# Altium schematic sheet AnalogOutput.SchDoc: Analog output
size A3; Author: eldar6776@hotmail.com; DrawnBy: Eldar Dediæ; Organization: PROVEN d.o.o.; Address1: Adema Buæe 102; Address2: 71000 Sarajevo; Address3: Federacija BiH; Address4: Bosna i Hercegovina; DocumentNumber: DE211213; Revision: 001; SheetNumber: 6; SheetTotal: 15; ProjectName: MIKSER SIROVINE
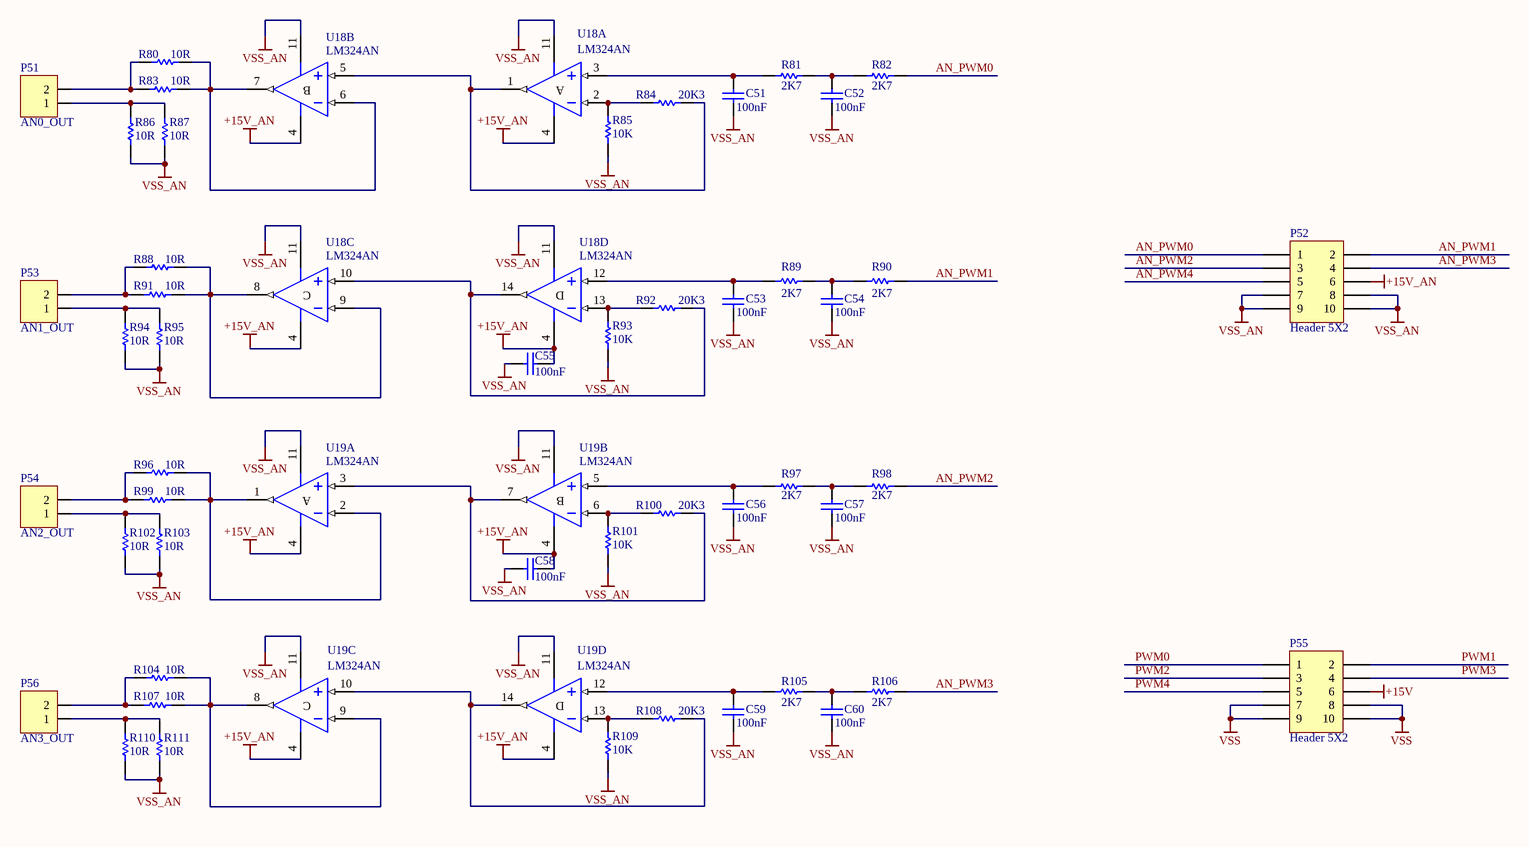
[diagram p0: AnalogOutput.SchDoc]

## Parts
C51  value 100nF  [1206]
C52  value 100nF  [1206]
C53  value 100nF  [1206]
C54  value 100nF  [1206]
C55  value 100nF  [1206]
C56  value 100nF  [1206]
C57  value 100nF  [1206]
C58  value 100nF  [1206]
C59  value 100nF  [1206]
C60  value 100nF  [1206]
P51  AN0_OUT  [TERMINAL BLOK 2]
P52  Header 5X2  [HDR2X5]
P53  AN1_OUT  [TERMINAL BLOK 2]
P54  AN2_OUT  [TERMINAL BLOK 2]
P55  Header 5X2  [HDR2X5]
P56  AN3_OUT  [TERMINAL BLOK 2]
R80  10R  [ERA-0603]
R81  2K7  [ERA-0603]
R82  2K7  [ERA-0603]
R83  10R  [ERA-0603]
R84  20K3  [ERA-0603]
R85  10K  [ERA-0603]
R86  10R  [ERA-0603]
R87  10R  [ERA-0603]
R88  10R  [ERA-0603]
R89  2K7  [ERA-0603]
R90  2K7  [ERA-0603]
R91  10R  [ERA-0603]
R92  20K3  [ERA-0603]
R93  10K  [ERA-0603]
R94  10R  [ERA-0603]
R95  10R  [ERA-0603]
R96  10R  [ERA-0603]
R97  2K7  [ERA-0603]
R98  2K7  [ERA-0603]
R99  10R  [ERA-0603]
R100  20K3  [ERA-0603]
R101  10K  [ERA-0603]
R102  10R  [ERA-0603]
R103  10R  [ERA-0603]
R104  10R  [ERA-0603]
R105  2K7  [ERA-0603]
R106  2K7  [ERA-0603]
R107  10R  [ERA-0603]
R108  20K3  [ERA-0603]
R109  10K  [ERA-0603]
R110  10R  [ERA-0603]
R111  10R  [ERA-0603]
U18  LM324AN  [DIP14]  (parts A,B,C,D of 4)
U19  LM324AN  [DIP14]  (parts A,B,C,D of 4)

## Nets
+15V: P55.6
+15V_AN: C55.1 C58.1 P52.6 U18.4(V+) U19.4(V+)
VSS: P55.7 P55.8 P55.9 P55.10
VSS_AN: C51.1 C52.1 C53.1 C54.1 C55.2 C56.1 C57.1 C58.2 C59.1 C60.1 P52.7 P52.8 P52.9 P52.10 R85.1 R86.1 R87.1 R93.1 R94.1 R95.1 R101.1 R102.1 R103.1 R109.1 R110.1 R111.1 U18.11(V-) U19.11(V-)
AN_PWM0: P52.1 R82.2
AN_PWM1: P52.2 R90.2
AN_PWM2: P52.3 R98.2
AN_PWM3: P52.4 R106.2
AN_PWM4: P52.5
PWM0: P55.1
PWM1: P55.2
PWM2: P55.3
PWM3: P55.4
PWM4: P55.5
NetC51_2: C51.2 R81.1 U18.3(IN+)
NetC52_2: C52.2 R81.2 R82.1
NetC53_2: C53.2 R89.1 U18.12(IN+)
NetC54_2: C54.2 R89.2 R90.1
NetC56_2: C56.2 R97.1 U19.5(IN+)
NetC57_2: C57.2 R97.2 R98.1
NetC59_2: C59.2 R105.1 U19.12(IN+)
NetC60_2: C60.2 R105.2 R106.1
NetP51_1: P51.1 R86.2 R87.2
NetP51_2: P51.2 R80.2 R83.2
NetP53_1: P53.1 R94.2 R95.2
NetP53_2: P53.2 R88.2 R91.2
NetP54_1: P54.1 R102.2 R103.2
NetP54_2: P54.2 R96.2 R99.2
NetP56_1: P56.1 R110.2 R111.2
NetP56_2: P56.2 R104.2 R107.2
NetR80_1: R80.1 R83.1 U18.6(IN-) U18.7(OUT)
NetR84_1: R84.1 R85.2 U18.2(IN-)
NetR84_2: R84.2 U18.1(OUT) U18.5(IN+)
NetR88_1: R88.1 R91.1 U18.8(OUT) U18.9(IN-)
NetR92_1: R92.1 R93.2 U18.13(IN-)
NetR92_2: R92.2 U18.10(IN+) U18.14(OUT)
NetR96_1: R96.1 R99.1 U19.1(OUT) U19.2(IN-)
NetR100_1: R100.1 R101.2 U19.6(IN-)
NetR100_2: R100.2 U19.3(IN+) U19.7(OUT)
NetR104_1: R104.1 R107.1 U19.8(OUT) U19.9(IN-)
NetR108_1: R108.1 R109.2 U19.13(IN-)
NetR108_2: R108.2 U19.10(IN+) U19.14(OUT)

## Notes on the sheet
- Title
- Size:
- Date:
- A3
- Number:
- Time:
- Revision:
- Sheet
- of
- File:
- (in symbol LM324AN, part A) A
- (in symbol LM324AN, part B) B
- (in symbol LM324AN, part C) C
- (in symbol LM324AN, part D) D

## Library data of the parts
C51-C60 = C1206: Ceramic Chip Capacitor - Standard; Published: 17-Jul-2002; LatestRevisionDate: 19-Mar-2004; LatestRevisionNote: Silkscreen size reduced.; DatasheetDocument: Mar-2001; PackageDocument: Mar-2001; PackageReference: 1206; Publisher: Altium Limited; Code_JEITA: 1206; Code_IPC: 3216 [1206]; ComponentLink1Description: Manufacturer Link; ComponentLink1URL: http://www.kemet.com/; ComponentLink2Description: Datasheet; ComponentLink2URL: http://www.kemet.com/kemet/web/homepage/kechome.nsf/vapubfilesname/F3102TA.pdf/$file/F3102TA.pdf
P51 P53 P54 P56 = TERMINAL BLOK 2: Terminal blok konektor 3,5 mm
P52 P55 = Header 5X2: Header, 5-Pin, Dual row; LatestRevisionDate: 17-Jul-2002; LatestRevisionNote: Re-released for DXP Platform.; Publisher: Altium Limited
R80-R111 = ERA3Y: Rectangular Thick Film Chip Resistor, 10 Ohm to 330k Ohm Range, 0.1% and 0.5% Tolerance, 0603 Size, 0.063 W; Note: If flow soldering, adjust pad width of PCB Footprint to 0.7 - 0.8 times the width of the resistor.; Published: 17-Dec-2003; LatestRevisionDate: 19-Mar-2004; LatestRevisionNote: Silkscreen size reduced.; PackageDocument: Mar-2003; PackageReference: ERA-0603; Publisher: Altium Limited; Code_IPC: 1608 [0603]; ComponentLink1Description: Manufacturer Link; ComponentLink1URL: http://www.panasonic.com/industrial/components/resistive_products.htm; ComponentLink2Description: Datasheet; ComponentLink2URL: http://www.panasonic.com/industrial/components/pdf/AOA0000CE8.pdf
U18 U19 = LM324AN: Low-Power Quad Operational Amplifier; Published: 24-Aug-2001; LatestRevisionDate: 06-Jun-2005; LatestRevisionNote: Stylized 3D Model Added.; DatasheetVersion: Nov-1997; PackageVersion: Jan-1997; PackageReference: DIP14; Publisher: Altium Limited; PackageDescription: DIP; 14 Leads; Row Spacing 7.62 mm; Pitch 2.54 mm; ComponentLink1Description: Manufacturer Link; ComponentLink1URL: http://www.st.com/; ComponentLink2Description: Datasheet; ComponentLink2URL: http://www.st.com/stonline/products/literature/ds/4797/lm224a.pdf